# EAGLE schematic keypad-ECAD (EAGLE 9.6.2)
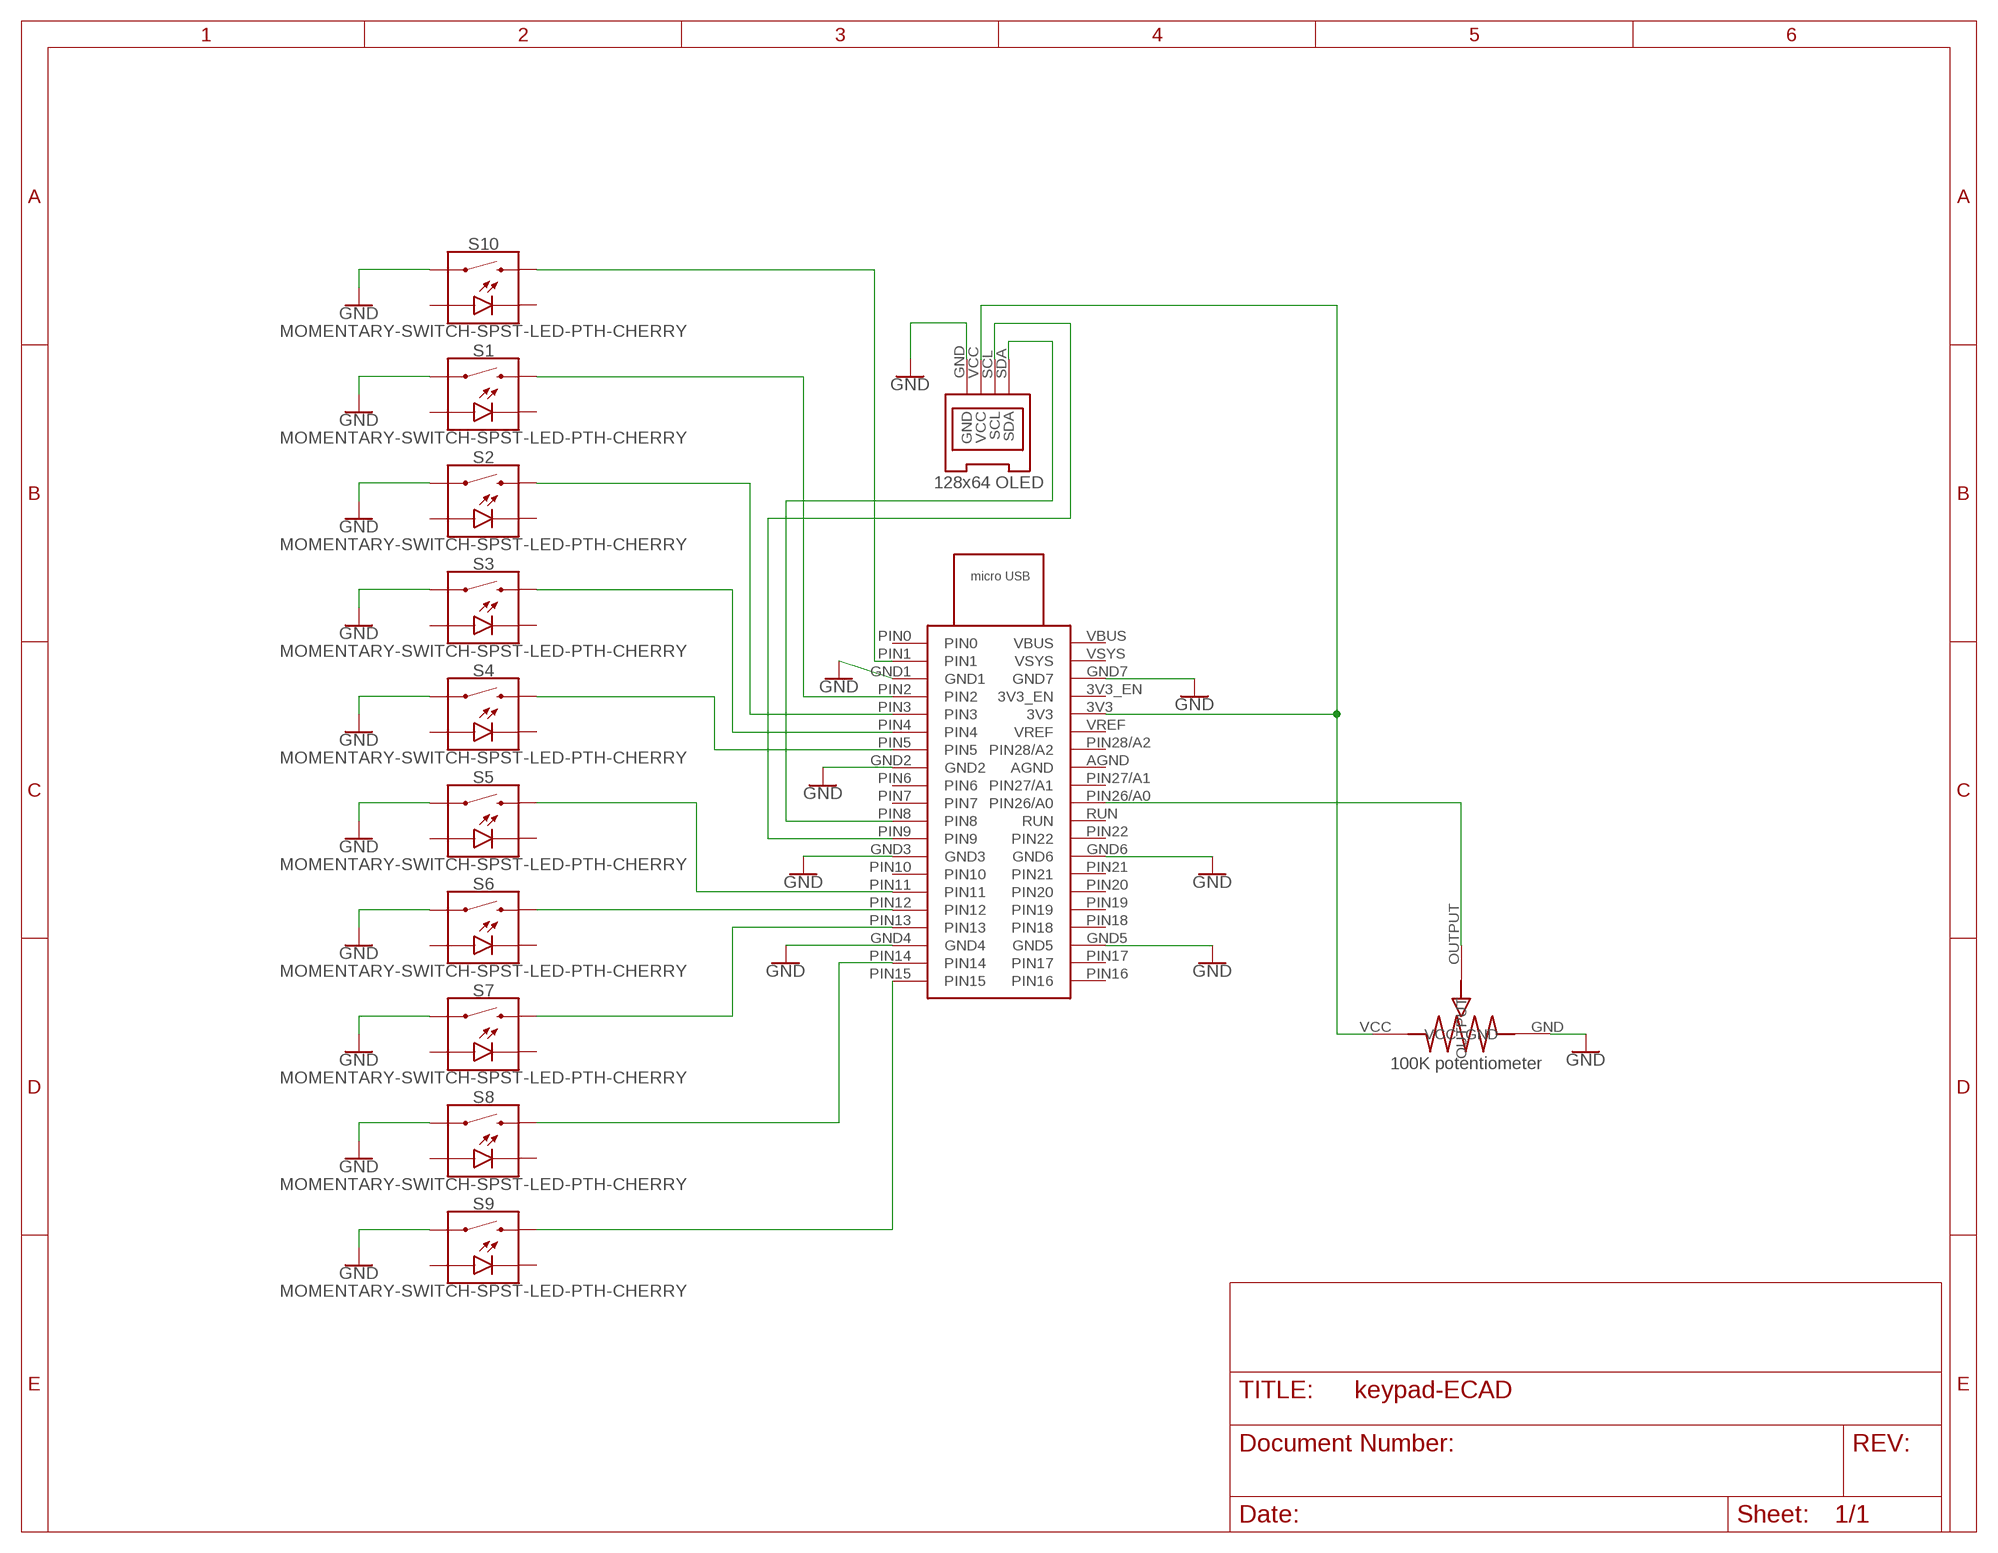
[diagram p0: schematic, sheet 1]

## Parts
S1  MOMENTARY-SWITCH-SPST-LED-PTH-CHERRY  [CHERRY-MX-LED]
S2  MOMENTARY-SWITCH-SPST-LED-PTH-CHERRY  [CHERRY-MX-LED]
S3  MOMENTARY-SWITCH-SPST-LED-PTH-CHERRY  [CHERRY-MX-LED]
S4  MOMENTARY-SWITCH-SPST-LED-PTH-CHERRY  [CHERRY-MX-LED]
S5  MOMENTARY-SWITCH-SPST-LED-PTH-CHERRY  [CHERRY-MX-LED]
S6  MOMENTARY-SWITCH-SPST-LED-PTH-CHERRY  [CHERRY-MX-LED]
S7  MOMENTARY-SWITCH-SPST-LED-PTH-CHERRY  [CHERRY-MX-LED]
S8  MOMENTARY-SWITCH-SPST-LED-PTH-CHERRY  [CHERRY-MX-LED]
S9  MOMENTARY-SWITCH-SPST-LED-PTH-CHERRY  [CHERRY-MX-LED]
S10  MOMENTARY-SWITCH-SPST-LED-PTH-CHERRY  [CHERRY-MX-LED]
U$1  RP-PICO  [RP-PICO]
U$2  128X64-I2C-OLED  [128X64-I2C-OLED]
U$3  KEYPAD_POT  [KEYPAD_POT]

## Nets
GND: S1.S1 S2.S1 S3.S1 S4.S1 S5.S1 S6.S1 S7.S1 S8.S1 S9.S1 S10.S1 U$1.GND1 U$1.GND2 U$1.GND3 U$1.GND4 U$1.GND5 U$1.GND6 U$1.GND7 U$2.GND U$3.GND
N$1: S9.S2 U$1.PIN15
N$2: S8.S2 U$1.PIN14
N$3: S7.S2 U$1.PIN13
N$4: S6.S2 U$1.PIN12
N$5: S5.S2 U$1.PIN11
N$6: U$1.PIN8 U$2.SDA
N$7: U$1.PIN9 U$2.SCL
N$8: S4.S2 U$1.PIN5
N$9: S3.S2 U$1.PIN4
N$10: U$1.3V3 U$2.VCC U$3.VCC
N$11: U$1.PIN26/A0 U$3.OUTPUT
N$12: S2.S2 U$1.PIN3
N$13: S1.S2 U$1.PIN2
N$16: S10.S2 U$1.PIN1
Unconnected: S1.A S1.K(C) S2.A S2.K(C) S3.A S3.K(C) S4.A S4.K(C) S5.A S5.K(C) S6.A S6.K(C) S7.A S7.K(C) S8.A S8.K(C) S9.A S9.K(C) S10.A S10.K(C) U$1.3V3_EN U$1.AGND U$1.PIN0 U$1.PIN6 U$1.PIN7 U$1.PIN10 U$1.PIN16 U$1.PIN17 U$1.PIN18 U$1.PIN19 U$1.PIN20 U$1.PIN21 U$1.PIN22 U$1.PIN27/A1 U$1.PIN28/A2 U$1.RUN U$1.VBUS U$1.VREF U$1.VSYS

## Library data of the parts
S1-S10 = SparkFun-Switches:MOMENTARY-SWITCH-SPST-LED: Momentary Switch (Pushbutton) - SPST - w/ LED Normally-open (NO) SPST momentary switches (buttons, pushbuttons), with a built-in LED. Variants PTH-CHERRY - Cherry MX Switch Cherry MX Keyswitches are top-of-the-line mechanical keyboard switches. They’re satisfyingly “clicky”, reliable up to tens-of-millions of key presses, and a standard in gaming and programming keyboards across the globe. This ‘blue’ version Cherry MX Switch is favored by most due to its secondary internal actuator making it less likely to “double-tap.” If you are looking for a noticeably audible and high-quality key switch, this is the perfect option for you! Cherry MX Switch <https://www.sparkfun.com/products/13834> (COM-13834) Cherry MX Switch Breakout <https://www.sparkfun.com/products/13773> (BOB-13773) PTH-12MM and PTH-12MM-KIT - 12mm Illuminated LED KIT variant is for soldering kits. There is no tStop (covering up the top side of the pads with mask). This helps the beginner see which side they should be soldering too. LED Tactile Button Breakout <https://www.sparkfun.com/products/10467> (BOB-10467) LED Tactile Button - Red <https://www.sparkfun.com/products/10442> (COM-10442) LED Tactile Button - Blue <https://www.sparkfun.com/products/10443> (COM-10443) LED Tactile Button - Green <https://www.sparkfun.com/products/10440> (COM-10440) LED Tactile Button - Orange <https://www.sparkfun.com/products/10441> (COM-10441) LED Tactile Button - White <https://www.sparkfun.com/products/10439> (COM-10439); SF_ID: COM-13834
U$1 = RP_Pico-pinout-throughole:RP-PICO
U$2 = 128X64-I2C-OLED:128X64-I2C-OLED
U$3 = 100K_potentiometer:KEYPAD_POT